# Altium schematic sheet SDC23-ESF.SchDoc
size A4
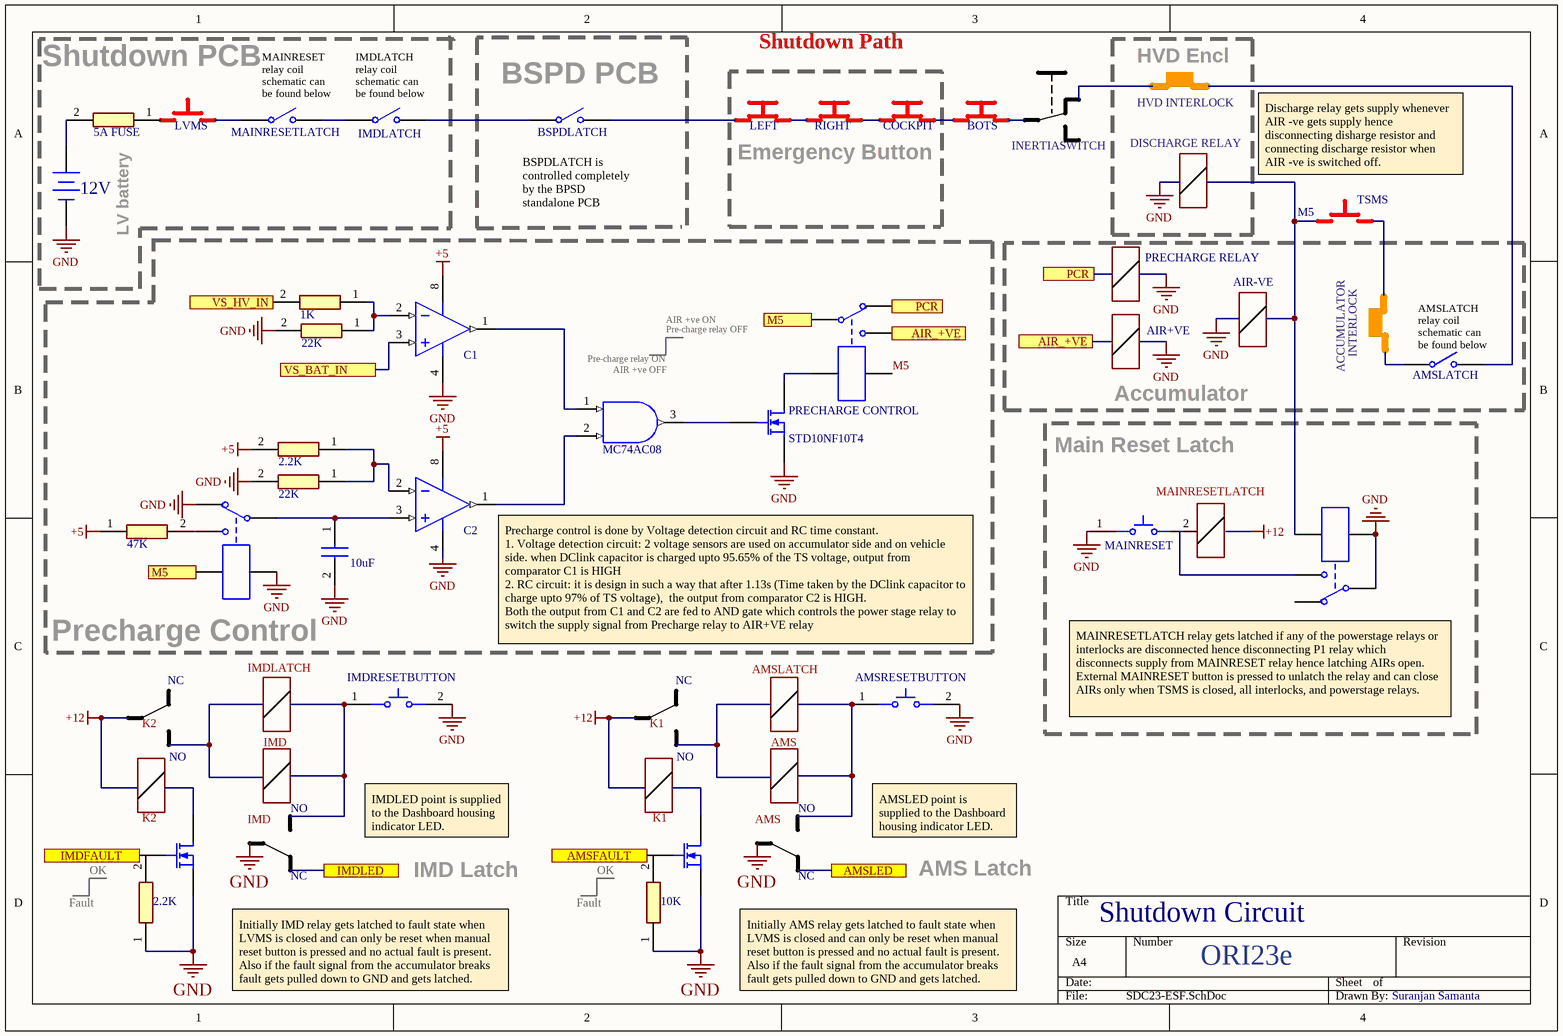
[diagram p0: SDC23-ESF.SchDoc]

## Parts
(Parts that share a designator on the sheet are numbered #1, #2 ... from top to bottom, then left to right.)
12V  Battery  [BAT-2]  (value not drawn)
?#1  STD10NF10T4  [E3]  (value not drawn)
?#2  STD10NF10T4  [E3]  (value not drawn)
AMSRESETBUTTON  (no value)  [OMRON-B3U-1000_V]
C?  10uF  [CAPC3225X230N]
IMDRESETBUTTON  (no value)  [OMRON-B3U-1000_V]
K?#1  Relay-SPDT  [MODULE5B]  (value not drawn)
K?#2  Relay-SPDT  [MODULE5B]  (value not drawn)
K?#3  Relay-SPDT  [MODULE5B]  (value not drawn)
MAINRESET  (no value)  [OMRON-B3U-1000_V]
Q?  STD10NF10T4  [E3]
R?#1  5A FUSE  [RESC0603X28N]
R?#2  1K  [RESC0603X28N]
R?#3  22K  [RESC0603X28N]
R?#4  2.2K  [RESC0603X28N]
R?#5  22K  [RESC0603X28N]
R?#6  47K  [RESC0603X28N]
R?#7  2.2K  [RESC0603X28N]
R?#8  10K  [RESC0603X28N]
S?#1  MAINRESETLATCH  [SPST-2]
S?#2  IMDLATCH  [SPST-2]
S?#3  BSPDLATCH  [SPST-2]
S?#4  AMSLATCH  [SPST-2]
U?#1  C1  [STM-SO-8_D_L]  (part A of 2)
U?#2  MC74AC08  [PW0014A_N]  (part A of 5)
U?#3  C2  [STM-SO-8_D_L]  (part A of 2)

## Blocks framed on the sheet
Precharge Control: C? K?#1 K?#2 Q? R?#2-R?#6 U?#1-U?#3
Accumulator: S?#4
Main Reset Latch: K?#3 MAINRESET

## Ports
AIR_+VE, AMSFAULT, AMSLED, IMDFAULT, IMDLED, M5, PCR, VS_BAT_IN, VS_HV_IN

## Nets
+5: R?#4.2 R?#6.1 U?#1.8(VCC+) U?#3.8(VCC+)
GND: 12V.2(-) ?#1.3(S) ?#2.3(S) AMSRESETBUTTON.2 C?.2 IMDRESETBUTTON.2 K?#2.2 K?#2.4 K?#3.1 K?#3.4 MAINRESET.1 Q?.3(S) R?#5.2 R?#7.1 R?#8.1 U?#1.4(VCC-) U?#3.4(VCC-)
AIR_+VE: K?#1.3 ; port AIR_+VE
AMSFAULT: ?#2.2(G) ; port AMSFAULT
IMDFAULT: ?#1.2(G) ; port IMDFAULT
M5: K?#1.1 K?#2.5 ; port M5
M5: K?#1.5  [a separate net that carries the same name]
PCR: K?#1.2 ; port PCR
VS_BAT_IN: U?#1.3(IN1+) ; port VS_BAT_IN
VS_HV_IN: R?#2.2 ; port VS_HV_IN
Net12V_1: 12V.1(+) R?#1.2
NetC?_1: C?.1 K?#2.1 U?#3.3(IN1+)
NetK?#1_4: K?#1.4 Q?.1(D)
NetK?#2_3: K?#2.3 R?#6.2
NetQ?_2: Q?.2(G) U?#2.3(1Y)
NetR?#2_1: R?#2.1 R?#3.1 U?#1.2(IN1-)
NetR?#4_1: R?#4.1 R?#5.1 U?#3.2(IN1-)
NetS?#1_2: S?#1.2(NO) S?#2.1(COMMON)
NetS?#2_2: S?#2.2(NO) S?#3.1(COMMON)
NetU?#1_1: U?#1.1(OUT1) U?#2.1(1A)
NetU?#2_2: U?#2.2(1B) U?#3.1(OUT1)

Not connected (* = marked no-connect by the designer): ?#1 1(D); ?#2 1(D); AMSRESETBUTTON 1; IMDRESETBUTTON 1; K?#3 2 3 5; MAINRESET 2; R?#1 1; R?#3 2; R?#7 2; R?#8 2; S?#1 1(COMMON); S?#3 2(NO); S?#4 1(COMMON) 2(NO)

## Notes on the sheet
- Shutdown PCB
- (near S?#1) MAINRESET relay coil schematic can be found below
- (near S?#2) IMDLATCH relay coil schematic can be found below
- (near S?#3) BSPD PCB
- Shutdown Path
- HVD INTERLOCK
- HVD Encl
- (near R?#1) LVMS
- Emergency Button
- LEFT
- RIGHT
- COCKPIT
- BOTS
- INERTIASWITCH
- DISCHARGE RELAY
- Discharge relay gets supply whenever AIR -ve gets supply hence disconnecting disharge resistor and connecting discharge resistor when AIR -ve is switched off.
- LV battery
- (near S?#3) BSPDLATCH is controlled completely by the BPSD standalone PCB
- M5
- TSMS
- PRECHARGE RELAY
- AIR-VE
- (near U?#2) Pre-charge relay ON
- (near U?#2) AIR +ve OFF
- AIR +ve ON
- Pre-charge relay OFF
- AIR+VE
- ACCUMULATOR
- INTERLOCK
- (near S?#4) AMSLATCH relay coil schematic can be found below
- (near Q?) PRECHARGE CONTROL
- (near MAINRESET) MAINRESETLATCH
- (near U?#3) Precharge control is done by Voltage detection circuit and RC time constant.
  1. Voltage detection circuit: 2 voltage sensors are used on accumulator side and on vehicle side. when DClink capacitor is charged upto 95.65% of the TS voltage, output from comparator C1 is HIGH
  2. RC circuit: it is design in such a way that after 1.13s (Time taken by the DClink capacitor to charge upto 97% of TS voltage),  the output from comparator C2 is HIGH.
  Both the output from C1 and C2 are fed to AND gate which controls the power stage relay to switch the supply signal from Precharge relay to AIR+VE relay
- NC
- IMDLATCH
- AMSLATCH
- (near K?#3) MAINRESETLATCH relay gets latched if any of the powerstage relays or interlocks are disconnected hence disconnecting P1 relay which disconnects supply from MAINRESET relay hence latching AIRs open. External MAINRESET button is pressed to unlatch the relay and can close AIRs only when TSMS is closed, all interlocks, and powerstage relays.
- K2
- NO
- IMD
- K1
- AMS
- (near ?#1) K2
- IMDLED point is supplied to the Dashboard housing indicator LED.
- (near ?#2) K1
- AMSLED point is supplied to the Dashboard housing indicator LED.
- Fault
- OK
- IMD Latch
- AMS Latch
- Shutdown Circuit
- Initially IMD relay gets latched to fault state when LVMS is closed and can only be reset when manual reset button is pressed and no actual fault is present. Also if the fault signal from the accumulator breaks fault gets pulled down to GND and gets latched.
- Initially AMS relay gets latched to fault state when LVMS is closed and can only be reset when manual reset button is pressed and no actual fault is present. Also if the fault signal from the accumulator breaks fault gets pulled down to GND and gets latched.
- ORI23e
- Suranjan Samanta
- Labels drawn without touching a wire or pin: GND

## Library data of the parts
12V = Battery: Multicell Battery; Published: 24-Mar-1999; LatestRevisionDate: 17-Jul-2002; LatestRevisionNote: Re-released for DXP Platform.; PackageReference: BAT-2; Publisher: Altium Limited; PackageDescription: Battery; 2 Leads
?#1 ?#2 Q? = MOSFET-N: N-Channel MOSFET; Published: 8-Jun-2000; LatestRevisionDate: 17-Jul-2002; LatestRevisionNote: Re-released for DXP Platform.; PackageVersion: 1995/1996; PackageReference: E3; Publisher: Altium Limited; PackageDescription: TO, Flat Index; 3 In-Line, Axial Leads; Body Dia. 4.6mm; Lead Dia. 0.5 mm (max)
AMSRESETBUTTON IMDRESETBUTTON MAINRESET = CMP-2100-03586-1: Ultra-Small Tactile Switch, 0.05 A, 12 V, -25 to 70 degC, 2-Pin SMD, RoHS, Tape and Reel; Manufacturer: Omron Electronic Components; Operating Force: 1.5N; Current Rating: 50mA; Voltage Rating (DC): 12V; Electrical Life: 200000Cycles; Actuator Length: 0.4mm; Insulation Resistance: 100MOhm; Switch Travel: 0.15mm; Throw Configuration: SPST; Illumination Type: Illuminated; Width: 3mm; Weight: 0.022g; Datasheet Version: 42005.0; Datasheet URL: http://www.omron.com/ecb/products/pdf/en-b3u.pdf; Height: 1.2mm; Package Quantity: 1; REACH SVHC: Unknown; Contact Current Rating: 50mA; Contact Material: Silver; Max Current Rating: 50mA; Package Reference: B3U-1000; Termination: SMD/SMT; Packaging: TapeandReel; Manufacturer URL: http://www.omron.com/; RoHSCompliant: true; Mount: SurfaceMount; Length: 4mm; Min Operating Temperature: -25degC; Depth: 2.5mm; Lead Free: LeadFree; Case/Package: SMD/SMT; Package Description: 2-Pin Surface Mount Device, Body 3 x 2.5 mm; Max Operating Temperature: 70degC; Orientation: Straight
C? = C3225X7R1N106K250AC: Capacitor; Manufacturer_Name: TDK; Datasheet Link: https://componentsearchengine.com/Datasheets/1/C3225X7R1N106K250AC.pdf; Height: 2.3mm; Mouser2 Part Number: 810-C3225X7R1N106K25; Mouser2 Price/Stock: https://www.mouser.com/Search/Refine.aspx?Keyword=810-C3225X7R1N106K25; Manufacturer_Part_Number: C3225X7R1N106K250AC
K?#1-K?#3 = Relay-SPDT: Single-Pole Dual-Throw Relay; Published: 24-Mar-1999; LatestRevisionDate: 17-Jul-2002; LatestRevisionNote: Re-released for DXP Platform.; PackageReference: MODULE5B; Publisher: Altium Limited
R?#1-R?#8 = CPF0201D100RE1: Resistor; Manufacturer_Name: TE Connectivity; Datasheet Link: http://www.te.com/commerce/DocumentDelivery/DDEController?Action=showdoc&DocId=Data+Sheet%7F1773200-1%7FA%7Fpdf%7FEnglish%7FENG_DS_1773200-1_A.pdf%7F4-2176215-6; Height: 0.28mm; Manufacturer_Part_Number: CPF0201D100RE1; Mouser Part Number: 279-CPF0201D100RE1; Mouser Price/Stock: https://www.mouser.com/Search/Refine.aspx?Keyword=279-CPF0201D100RE1; RS Part Number: 7549192; RS Price/Stock: http://uk.rs-online.com/web/p/products/7549192
S?#1-S?#4 = SW-SPST: Single-Pole, Single-Throw Switch; Published: 24-Mar-1999; LatestRevisionDate: 17-Jul-2002; LatestRevisionNote: Re-released for DXP Platform.; PackageReference: SPST-2; Publisher: Altium Limited; PackageDescription: Switch; 2 Leads
U?#1 U?#3 = CMP-2000-06550-1: Low-Power, Dual-Voltage Comparator, 2 to 36 V, 0 to 70 degC, 8-Pin SOIC (SO), RoHS, Tape and Reel; Manufacturer: STMicroelectronics; Voltage - Supply, Single/Dual (±): 2V~36V,±1V~18V; Current - Input Bias (Max): 0.25µA@5V; Number of Elements: 2; Current - Output (Typ): 18mA@5V; Other Names: 497-1593-2; Voltage - Input Offset (Max): 5mV@30V; Output Type: CMOS,DTL,ECL,MOS,Open-Collector,TTL; EDA / CAD Models: DownloadfromAcceleratedDesigns; Other Related Documents: LM393ViewAllSpecificationsLM393ViewAllSpecifications; Online Catalog: Comparators-2elements; Current - Quiescent (Max): 2.5mA; Standard Package: 2,500; Manufacturer URL: http://www.st.com/; Package Description: 8-Pin Small Outline Integrated Circuit, Body 4.9 x 3.9 mm, Pitch 1.27 mm; Packaging: Tape&Reel(TR); Datasheet Version: Rev. 15, 02/2016; Category: IntegratedCircuits(ICs); Operating Temperature: 0°C~70°C; Mounting Type: SurfaceMount; Supplier Device Package: 8-SO; Datasheet URL: http://www.st.com/content/ccc/resource/technical/document/datasheet/group1/b4/cc/cf/13/18/28/44/f5/CD00000465/files/CD00000465.pdf/jcr:content/translations/en.CD00000465.pdf; Family: Linear-Comparators; Mounting Technology: SurfaceMount; Type: GeneralPurpose; Package Reference: SO-8; Package / Case: 8-SOIC(0.154",3.90mmWidth)
U?#2 = CMP-0777-00390-3: Quadruple 2-Input Positive-AND Gates, PW0014A, LARGE T&R; Generic Part Number: SN74AHCT08; Manufacturer: Texas Instruments; Output Type: CMOS; VCC(Min)(V): 4.5; Technology Family: AHCT; tpd @ Nom Voltage(Max)(ns): 8; Bits(#): 4; Input Type: TTL; Schmitt Trigger: No; Voltage(Nom)(V): 5; VCC(Max)(V): 5.5; Output Drive (IOL/IOH)(Max)(mA): -8/8; Rating: Catalog; ICC @ Nom Voltage(Max)(mA): 0.02; F @ Nom Voltage(Max)(Mhz): 70; DatasheetVersion: SCLS237M; Operating Temperature Range(C): -40 to 125,-40 to 85; PackageReference: PW0014A